# Altium schematic sheet Top Sheet.SchDoc
size Letter; Address4: USA
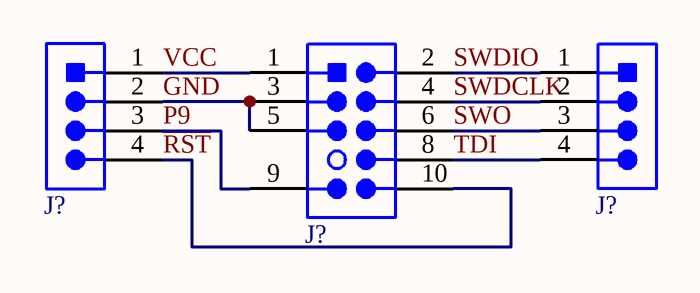
[diagram p0: Top Sheet.SchDoc]

## Parts
(Parts that share a designator on the sheet are numbered #1, #2 ... from top to bottom, then left to right.)
J?#1  4 contacts Male header  [61300411121]  (value not drawn)
J?#2  Cortex Debug, 0.050" 10 Pin  [FTSH-105-01-F-DV-007-K]  (value not drawn)
J?#3  4 contacts Male header  [61300411121]  (value not drawn)

## Nets
~{RST}: J?#1.4 J?#2.10(~{RESET})
GND: J?#1.2 J?#2.3(GND) J?#2.5(GND)
P9: J?#1.3 J?#2.9(GNDDetect)
SWDCLK: J?#2.4(SWDCLK/TCK) J?#3.2
SWDIO: J?#2.2(SWDIO/TMS) J?#3.1
SWO: J?#2.6(SWO/TDO) J?#3.3
TDI: J?#2.8(NC/TDI) J?#3.4
VCC: J?#1.1 J?#2.1(VCC)

## Notes on the sheet
- Title:
- Desc:
- Size:
- Date:
- File:
- Repo:
- Letter
- Auth:
- Time:
- Sheet
- Proj:
- of

## Library data of the parts
J?#1 J?#3 = 61300411121: Connector Male Header 1X4 vertical 4contacts 0.100in pitch 30uin Gold finish TH; Manufacturer: Würth Elektronik; Description in Visual: Con Hdr Male 4contacts vertical 1X4; Number of Contacts: 4; P/N: 61300411121; Manufacturer P/N: 61300411121; Orientation: vertical; Number of Rows: 1.00; Pitch: 0.100in; Contact Finish: Gold; Gender: Male; ComponentLink1Description: Manufacturer Website; ComponentLink1URL: https://www.we-online.com/web/en/wuerth_elektronik/start.php; ComponentLink2Description: Component Datasheet; ComponentLink2URL: https://www.we-online.de/katalog/datasheet/6130xx11121.pdf; ComponentLink3Description: Octopart Link; ComponentLink3URL: https://octopart.com/61300411121-w%C3%BCrth+elektronik-32855522?r=sp
J?#2 = ARM Cortex Debug: 10 Pin Shrouded Header, 0.050", Key Pin 7; Manufacturer: Samtech; Manufacturer P/N: Various; Number of Contacts: 10; Gender: Male; P/N: ARM Cortex Debug; Description in Visual: 10 Pin Shrouded Header, 0.050", Key Pin 7; Orientation: Vertical; Number of Rows: 2; Pitch: 0.050"; Contact Finish: Gold; ComponentLink1Description: Pinout Reference; ComponentLink1URL: http://infocenter.arm.com/help/topic/com.arm.doc.faqs/attached/13634/cortex_debug_connectors.pdf; ComponentLink2Description: Datasheet for Connector; ComponentLink2URL: http://suddendocs.samtec.com/catalog_english/ftsh_smt.pdf; Supplier 3: Digi-Key; Supplier Part Number 3: SAM11250-ND; Supplier 1: Digi-Key; Supplier Part Number 1: SAM15640-ND; Supplier 2: Digi-Key; Supplier Part Number 2: SAM13926CT-ND